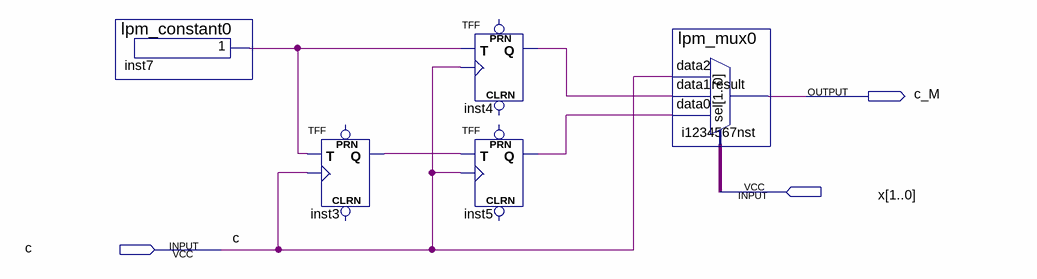
[diagram p0: schematic sheet]
// Quartus schematic create_output_tact.bdf as structural Verilog: 5 symbols, 3 pins
module create_output_tact (
  input  [1:0] x,
  input  c,
  output c_M
);

  wire inst3_q, inst4_q, inst5_q, inst7_result;

  lpm_constant0 inst7 (.result(inst7_result));
  TFF inst3 (.T(inst7_result), .CLK(c), .Q(inst3_q));  // open: PRN, CLRN
  TFF inst4 (.T(inst7_result), .CLK(c), .Q(inst4_q));  // open: PRN, CLRN
  TFF inst5 (.T(inst3_q), .CLK(c), .Q(inst5_q));  // open: PRN, CLRN
  lpm_mux0 i1234567nst (.data2(c), .data1(inst4_q), .data0(inst5_q), .sel(x), .result(c_M));
endmodule
